# EAGLE design motor_board (EAGLE 9.5.2)
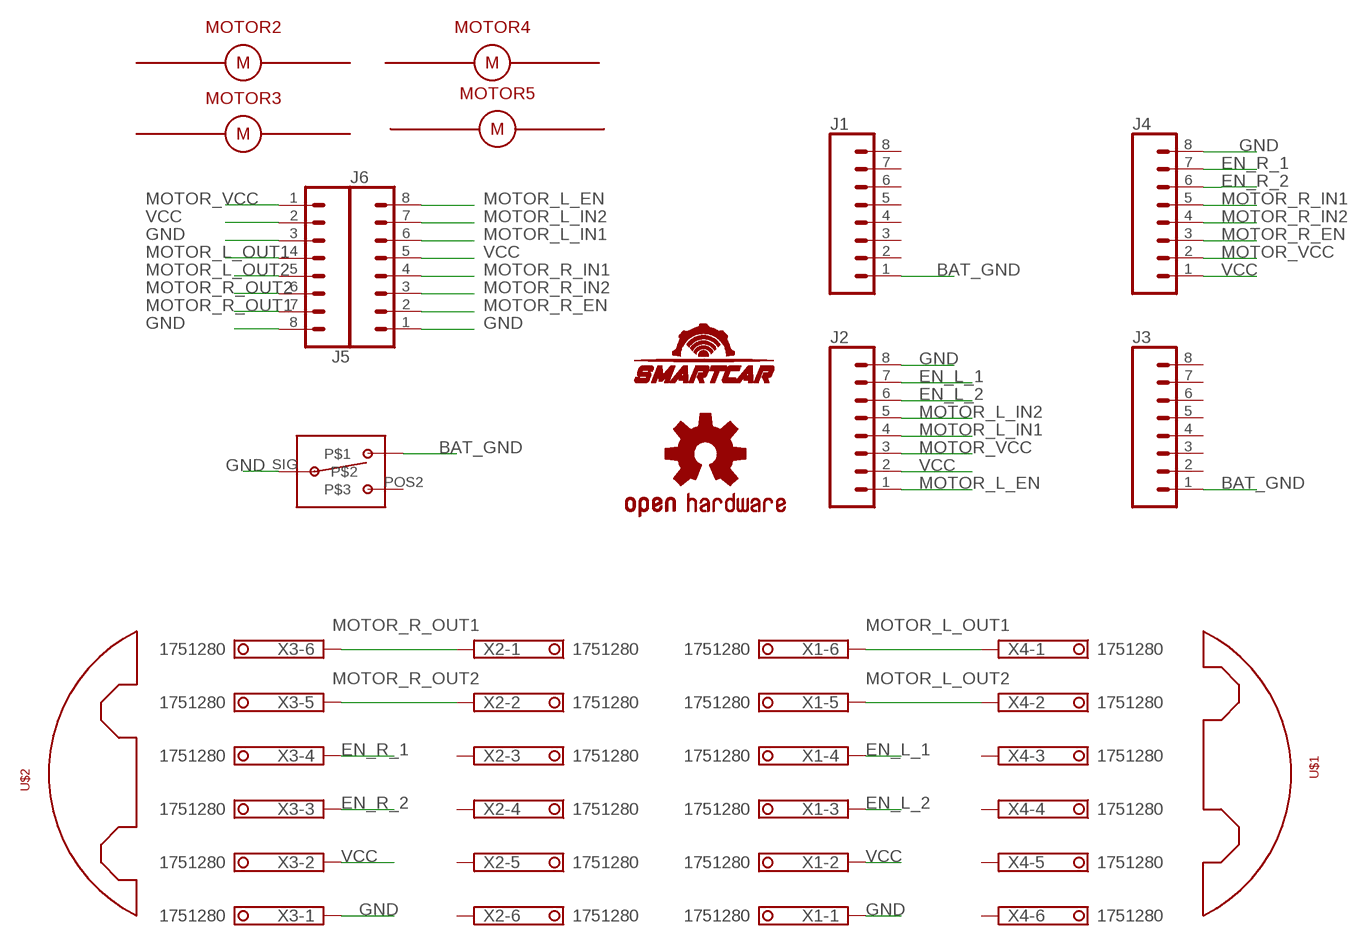
[diagram p0: schematic, sheet 1]

## Parts
J1  CONN_08NO_SILK_FEMALE_PTH  [1X08_NO_SILK]
J2  CONN_08NO_SILK_FEMALE_PTH  [1X08_NO_SILK]
J3  CONN_08NO_SILK_FEMALE_PTH  [1X08_NO_SILK]
J4  CONN_08NO_SILK_FEMALE_PTH  [1X08_NO_SILK]
J5  CONN_08"  [1X08]
J6  CONN_08"  [1X08]
LOGO1  OSHW-LOGOL  [OSHW-LOGO-L]
MOTOR2  SMARTCAR_MOTOR  [SMARTCAR_MOTOR_MOUNT_HOLES]
MOTOR3  SMARTCAR_MOTOR  [SMARTCAR_MOTOR_MOUNT_HOLES]
MOTOR4  SMARTCAR_MOTOR  [SMARTCAR_MOTOR_MOUNT_HOLES]
MOTOR5  SMARTCAR_MOTOR  [SMARTCAR_MOTOR_MOUNT_HOLES]
SMRTCR1  SMARTCAR_LOGOMEDIUM  [SMARTCAR_LOGO_MEDIUM]
SW1  SPDT-HIGH-AMP-SWITCHPTH  [SPDT-0.2-THICK-PINS]
U$1  BUMPER_020522_SCREWS  [BUMPER_2_SCREWS_NARROW]
U$2  BUMPER_020522_SCREWS  [BUMPER_2_SCREWS_NARROW]
X1  1751280  [1751280]
X2  1751280  [1751280]
X3  1751280  [1751280]
X4  1751280  [1751280]

## Nets
BAT_GND: J1.1 J3.1 SW1.POS1
EN_L_1: J2.7 X1.4
EN_L_2: J2.6 X1.3
EN_R_1: J4.7 X3.4
EN_R_2: J4.6 X3.3
GND: J2.8 J4.8 J5.3 J5.8 J6.1 SW1.SIG X1.1 X3.1
MOTOR_L_EN: J2.1 J6.8
MOTOR_L_IN1: J2.4 J6.6
MOTOR_L_IN2: J2.5 J6.7
MOTOR_L_OUT1: J5.4 X1.6 X4.1
MOTOR_L_OUT2: J5.5 X1.5 X4.2
MOTOR_R_EN: J4.3 J6.2
MOTOR_R_IN1: J4.5 J6.4
MOTOR_R_IN2: J4.4 J6.3
MOTOR_R_OUT1: J5.7 X2.1 X3.6
MOTOR_R_OUT2: J5.6 X2.2 X3.5
MOTOR_VCC: J2.3 J4.2 J5.1
VCC: J2.2 J4.1 J5.2 J6.5 X1.2 X3.2
Unconnected: J1.2 J1.3 J1.4 J1.5 J1.6 J1.7 J1.8 J3.2 J3.3 J3.4 J3.5 J3.6 J3.7 J3.8 SW1.POS2 X2.3 X2.4 X2.5 X2.6 X4.3 X4.4 X4.5 X4.6

## Library data of the parts
J1-J6 = SparkFun-Connectors:CONN_08: Multi connection point. Often used as Generic Header-pin footprint for 0.1 inch spaced/style header connections On any of the 0.1 inch spaced packages, you can populate with these: Break Away Headers - Straight <https://www.sparkfun.com/products/116> (PRT-00116) Break Away Male Headers - Right Angle <https://www.sparkfun.com/products/553> (PRT-00553) Female Headers <https://www.sparkfun.com/products/115> (PRT-00115) Break Away Headers - Machine Pin <https://www.sparkfun.com/products/117> (PRT-00117) Break Away Female Headers - Swiss Machine Pin <https://www.sparkfun.com/products/743> (PRT-00743) Arduino Stackable Header - 8 Pin <https://www.sparkfun.com/products/9279> (PRT-09279) For SCREWTERMINALS and SPRING TERMINALS visit here: Screw Terimnals on SparkFun.com <https://www.sparkfun.com/search/results?term=Screw+Terminals> (5mm/3.5mm/2.54mm spacing) This device is also useful as a general connection point to wire up your design to another part of your project. Our various solder wires solder well into these plated through hole pads. Hook-Up Wire - Assortment (Stranded, 22 AWG) <https://www.sparkfun.com/products/11375> (PRT-11375) Hook-Up Wire - Assortment (Solid Core, 22 AWG) <https://www.sparkfun.com/products/11367> (PRT-11367) View the entire wire category on our website here <https://www.sparkfun.com/categories/141> Special notes: Molex polarized connector foot print use with SKU : PRT-08231 with associated crimp pins and housings. 1MM SMD Version SKU: PRT-10208 NOTES ON THE VARIANTS LOCK and LOCK_LONGPADS... This footprint was designed to help hold the alignment of a through-hole component (i.e. 6-pin header) while soldering it into place. You may notice that each hole has been shifted either up or down by 0.005 of an inch from it's more standard position (which is a perfectly straight line). This slight alteration caused the pins (the squares in the middle) to touch the edges of the holes. Because they are alternating, it causes a "brace" to hold the component in place. 0.005 has proven to be the perfect amount of "off-center" position when using our standard breakaway headers. Although looks a little odd when you look at the bare footprint, once you have a header in there, the alteration is very hard to notice. Also,if you push a header all the way into place, it is covered up entirely on the bottom side.; PROD_ID: CONN-08438
LOGO1 = SparkFun-Aesthetics:OSHW-LOGO: Open-Source Hardware (OSHW) Logo This logo indicates the piece of hardware it is found on incorporates a OSHW license and/or adheres to the definition of open source hardware found here: http://freedomdefined.org/OSHW
MOTOR2-MOTOR5 = my_parts:SMARTCAR_MOTOR
SMRTCR1 = my_parts:SMARTCAR_LOGO: Smartcar logo on the silk layer
SW1 = my_parts:SPDT-HIGH-AMP-SWITCH: SPDT high power switch
U$1 U$2 = my_parts:BUMPER_02052
X1-X4 = con-phoenix-350:1751280: MKDS 1/ 6-3,5 Printklemme Nennstrom: 10 A Bemessungsspannung: 160 V Raster: 3,5 mm Polzahl: 6 Montageart: Löten Anschlussart: Schraubanschluss Anschlussrichtung vom Leiter zur Platine: 0° Source: http://eshop.phoenixcontact.com .. 1751280.pdf; MPN: 1751280; OC_FARNELL: unknown; OC_NEWARK: 27R1765

## Net classes
0 default: width 0.152 mm, drill 0.305 mm, clearance 0.152 mm

## Board
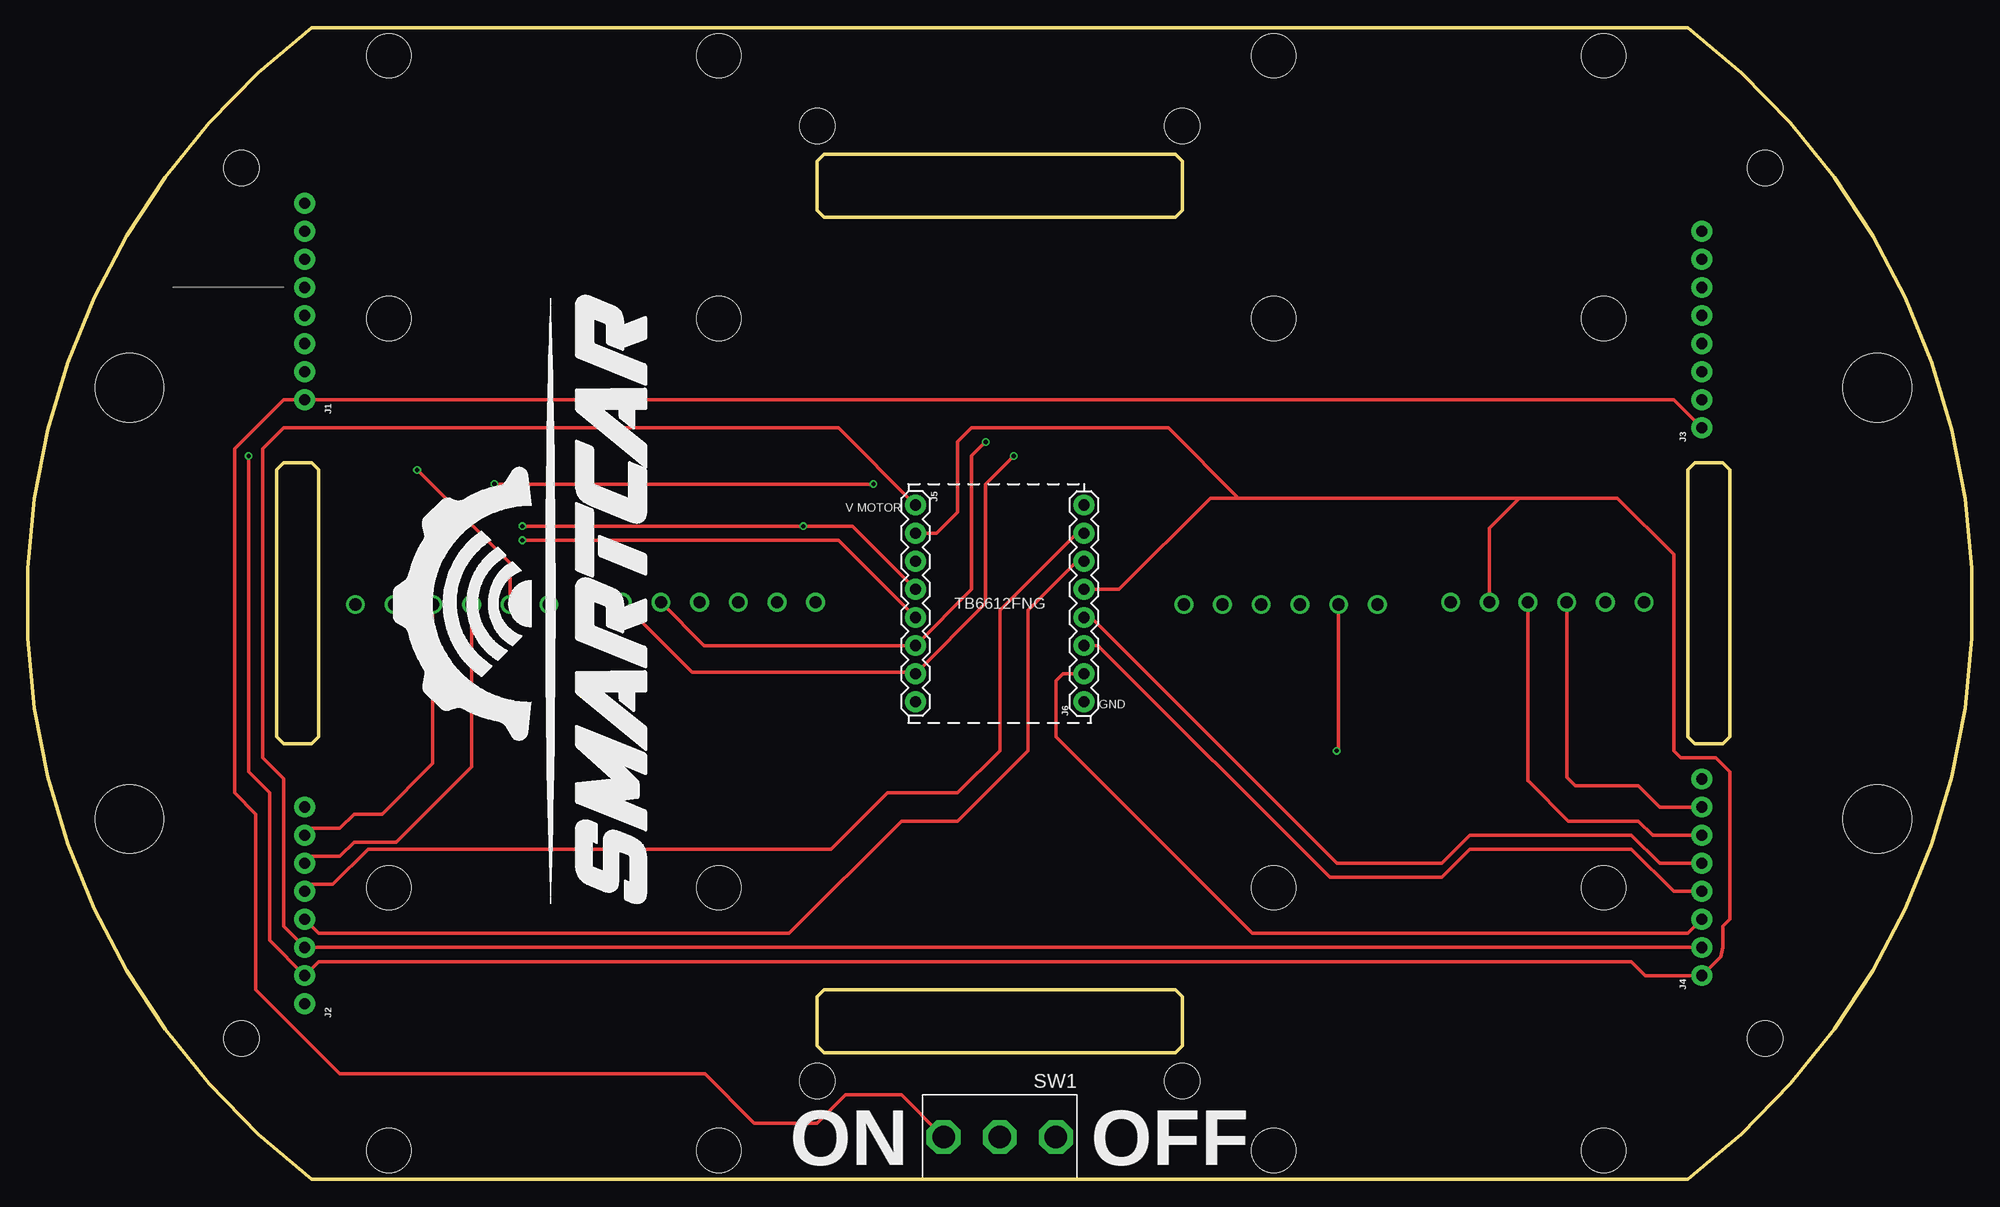
[diagram p1: board, top side]
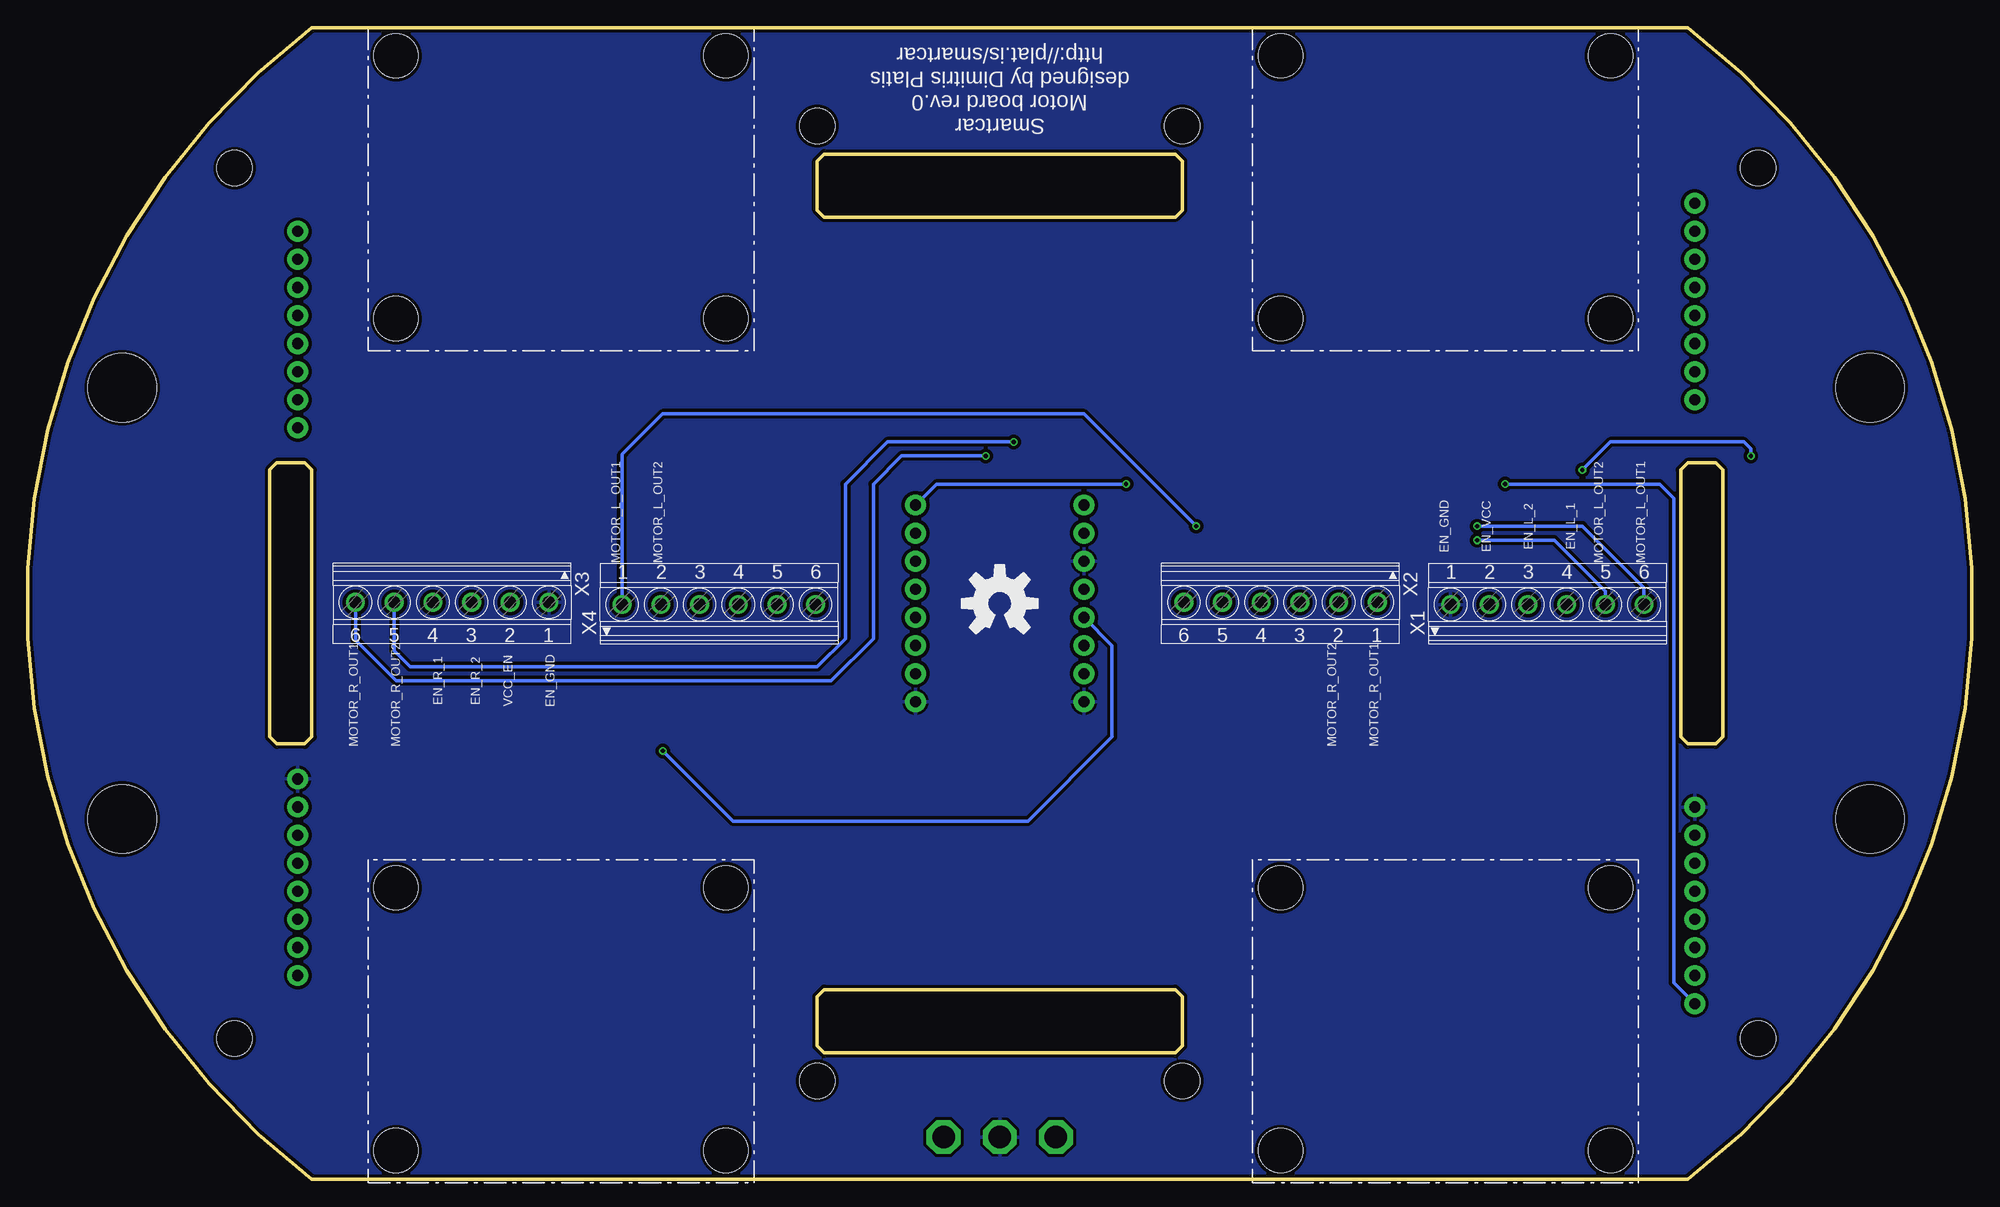
[diagram p2: board, bottom side, seen from below]

Size 175.87 x 104.14 mm. Coordinates in mm from the lower left corner, seen from the top.
Outline: 150.17,0 25.71,0 arc-105 25.71,104.14 150.17,104.14 arc-105 150.17,0
Outline: 22.53,40 22.53,64.14 23.17,64.77 25.71,64.77 26.34,64.14 26.34,40 25.71,39.37 23.17,39.37 22.53,40
Outline: 150.17,40 150.17,64.14 150.8,64.77 153.34,64.77 153.98,64.14 153.98,40 153.34,39.37 150.8,39.37 150.17,40
Outline: 72.06,11.43 103.81,11.43 104.45,12.07 104.45,16.51 103.81,17.14 72.06,17.14 71.43,16.51 71.43,12.07 72.06,11.43
Outline: 72.06,87 103.81,87 104.45,87.63 104.45,92.08 103.81,92.71 72.06,92.71 71.43,92.08 71.43,87.63 72.06,87
Copper layers (1*16): Top 0.035mm / dielectric 1.5mm / Bottom 0.035mm
Design rules "SeeedStudio_2layer_DRU_edited": minimum track width 7mil, minimum drill 15mil, track to track 6mil, track to pad 6mil, pad to pad 6mil, via to via 6mil, smd to smd 0mil, copper to edge 10mil, drill to drill 10mil, minimum pad ring 10mil, minimum via ring 6mil, stop-mask expansion 2mil, vias tented up to drill 100mil, thermal gap 10mil
Holes 3.2 mm at 19.36,91.44 157.15,91.44 19.36,12.7 157.15,12.7 104.45,8.89 71.43,8.89 71.43,95.25 104.45,95.25

### Footprints (pad centres in the part's own frame; a part is rotated, then mirrored left to right if it is on the bottom)
1X08_NO_SILK = drill 1.016 pad 1.88: 1 0,0; 2 2.54,0; 3 5.08,0; 4 7.62,0; 5 10.16,0; 6 12.7,0; 7 15.24,0; 8 17.78,0
1X08 = drill 1.016 pad 1.88: 1 0,0; 2 2.54,0; 3 5.08,0; 4 7.62,0; 5 10.16,0; 6 12.7,0; 7 15.24,0; 8 17.78,0
SMARTCAR_MOTOR_MOUNT_HOLES = hole 4: 14.605,-11.709; 14.605,12.065; -15.24,-11.709; -15.24,12.065
SPDT-0.2-THICK-PINS = drill 2.032 octagon: POS1 0,5.08; POS2 0,-5.08; SIG 0,0
BUMPER_2_SCREWS_NARROW = hole 6.2: 0,19.5; 0,-19.5
1751280 = drill 1.1 pad 1.7: 1 -8.75,-0.1; 2 -5.25,-0.1; 3 -1.75,-0.1; 4 1.75,-0.1; 5 5.25,-0.1; 6 8.75,-0.1

### Placement (x,y rotation side)
J1  25.07,70.48 90 top
J2  25.07,15.88 90 top
J3  151.44,67.95 90 top
J4  151.44,18.41 90 top
J5  80.32,60.96 270 top
J6  95.56,43.18 90 top
LOGO1  87.94,52.07 0 bottom
MOTOR2  47.3,14.29 0 bottom
MOTOR3  127.31,14.29 0 bottom
MOTOR4  127.31,89.53 0 bottom
MOTOR5  47.3,89.53 0 bottom
SMRTCR1  47.3,52.07 90 top
SW1  87.94,3.81 90 top
U$1  9.2,52.07 0 top
U$2  167.31,52.07 0 top
X1  38.41,52.07 0 bottom
X2  62.54,52.07 180 bottom
X3  137.47,52.07 180 bottom
X4  113.34,52.07 0 bottom

### Tracks (layer width: path | path; a pad name or v marks a point on that pad's centre or on a via)
BAT_GND
  Top 0.305: J3.1 148.9,70.48 J1.1 23.17,70.48 18.72,66.04 18.72,34.92 20.63,33.02 20.63,17.14 28.25,9.53 61.27,9.53 65.71,5.08 71.43,5.08 73.97,7.62 79.05,7.62 SW1.POS1
EN_L_1
  Top 0.305: J2.7 25.71,31.75 28.25,31.75 29.52,33.02 32.06,33.02 36.66,37.62 X1.4
EN_L_2
  Top 0.305: J2.6 25.71,29.21 28.25,29.21 29.52,30.48 33.33,30.48 40.16,37.31 40.16,37.62 40.16,38.1 X1.3
EN_R_1
  Top 0.305: J4.7 147.63,33.66 145.72,35.56 140.01,35.56 139.22,36.35 X3.4
EN_R_2
  Top 0.305: J4.6 146.99,31.12 145.72,32.38 139.37,32.38 135.88,35.88 135.72,36.04 X3.3
GND
  pour Bottom (isolate 0.305): 9.83,111.12 153.34,111.12 177.47,87 177.47,13.97 152.71,-10.79 19.99,-10.79 -2.23,11.43 -2.23,99.06
MOTOR_L_EN  (via drill 0.38)
  Top 0.305: v42.22,62.86 v76.51,62.86
  Bottom 0.305: J2.1 26.98,17.78 26.98,61.59 28.25,62.86 v42.22,62.86 | J6.8 93.65,62.86 v76.51,62.86
MOTOR_L_IN1
  Top 0.305: J6.6 94.92,55.88 90.48,51.43 90.48,38.73 84.13,32.38 79.05,32.38 68.89,22.23 26.34,22.23 J2.4
MOTOR_L_IN2
  Top 0.305: J6.7 94.92,58.42 87.94,51.43 87.94,38.73 84.13,34.92 77.78,34.92 72.7,29.84 30.79,29.84 27.61,26.67 25.71,26.67 J2.5
MOTOR_L_OUT1  (via drill 0.38)
  Top 0.305: v44.76,59.05 v70.16,59.05 74.6,59.05 J5.4
  Bottom 0.305: v44.76,59.05 35.23,59.05 29.66,53.48 X1.6 | v70.16,59.05 80.32,69.22 118.42,69.22 121.91,65.72 122.09,65.55 X4.1
MOTOR_L_OUT2  (via drill 0.38)
  Top 0.305: v44.76,57.78 73.33,57.78 J5.5 | X4.2 118.59,38.91 v118.42,38.73
  Bottom 0.305: J5.5 77.78,48.26 77.78,40 85.4,32.38 112.07,32.38 v118.42,38.73 | X1.5 33.16,53.17 37.77,57.78 v44.76,57.78
MOTOR_R_EN
  Top 0.305: J6.2 93.65,45.72 93.02,45.09 93.02,40 110.8,22.23 150.17,22.23 J4.3
MOTOR_R_IN1
  Top 0.305: J6.4 96.19,50.8 118.42,28.58 127.94,28.58 130.48,31.12 145.09,31.12 147.63,28.58 J4.5
MOTOR_R_IN2
  Top 0.305: J6.3 96.83,48.26 117.78,27.3 127.94,27.3 130.48,29.84 145.09,29.84 148.9,26.03 J4.4
MOTOR_R_OUT1  (via drill 0.38)
  Top 0.305: v89.21,65.41 86.67,62.86 86.67,52.07 J5.7 80.2,45.84 60.12,45.84 X2.1
  Bottom 0.305: v89.21,65.41 96.83,65.41 99.37,62.86 99.37,48.89 103.18,45.09 142.55,45.09 146.22,48.75 X3.6
MOTOR_R_OUT2  (via drill 0.38)
  Top 0.305: v86.67,66.67 85.4,65.41 85.4,53.34 J5.6 61.2,48.26 X2.2
  Bottom 0.305: v86.67,66.67 98.1,66.67 101.91,62.86 101.91,48.89 104.45,46.35 141.28,46.35 142.72,47.8 X3.5
MOTOR_VCC
  Top 0.305: J4.2 J2.3 23.17,22.86 23.17,36.2 21.26,38.1 21.26,66.04 21.9,66.67 22.21,66.99 23.17,67.95 73.33,67.95 J5.1
VCC  (via drill 0.38)
  Top 0.305: 109.53,61.59 134.93,61.59 | J6.5 98.73,53.34 106.99,61.59 109.53,61.59 | J5.2 82.22,58.42 84.13,60.32 84.13,66.67 85.4,67.95 103.18,67.95 109.53,61.59 | X3.2 132.22,58.88 134.93,61.59 | X1.2 43.66,55.71 v35.23,64.14 | 134.93,61.59 143.82,61.59 148.9,56.52 148.9,38.73 149.53,38.1 152.71,38.1 153.98,36.83 153.98,23.49 153.34,22.86 153.34,20.96 153.16,20.13 J4.1 146.36,18.41 145.09,19.69 26.34,19.69 J2.2 21.9,21.59 21.9,34.92 19.99,36.83 v19.99,65.41
  Bottom 0.305: v19.99,65.41 19.99,66.04 20.63,66.67 32.69,66.67 v35.23,64.14

### Text on the board
tPlace: V MOTOR | TB6612FNG | GND | ON | OFF
bPlace: Smartcar / Motor board rev.0 / designed by Dimitris Platis / http://plat.is/smartcar | MOTOR_L_OUT1 | MOTOR_L_OUT2 | MOTOR_L_OUT2 | MOTOR_L_OUT1 | EN_L_1 | EN_L_2 | EN_VCC | EN_GND | EN_GND | VCC_EN | EN_R_2 | EN_R_1 | MOTOR_R_OUT1 | MOTOR_R_OUT2 | MOTOR_R_OUT2 | MOTOR_R_OUT1